# EAGLE design Moteino (EAGLE 7.7.0)
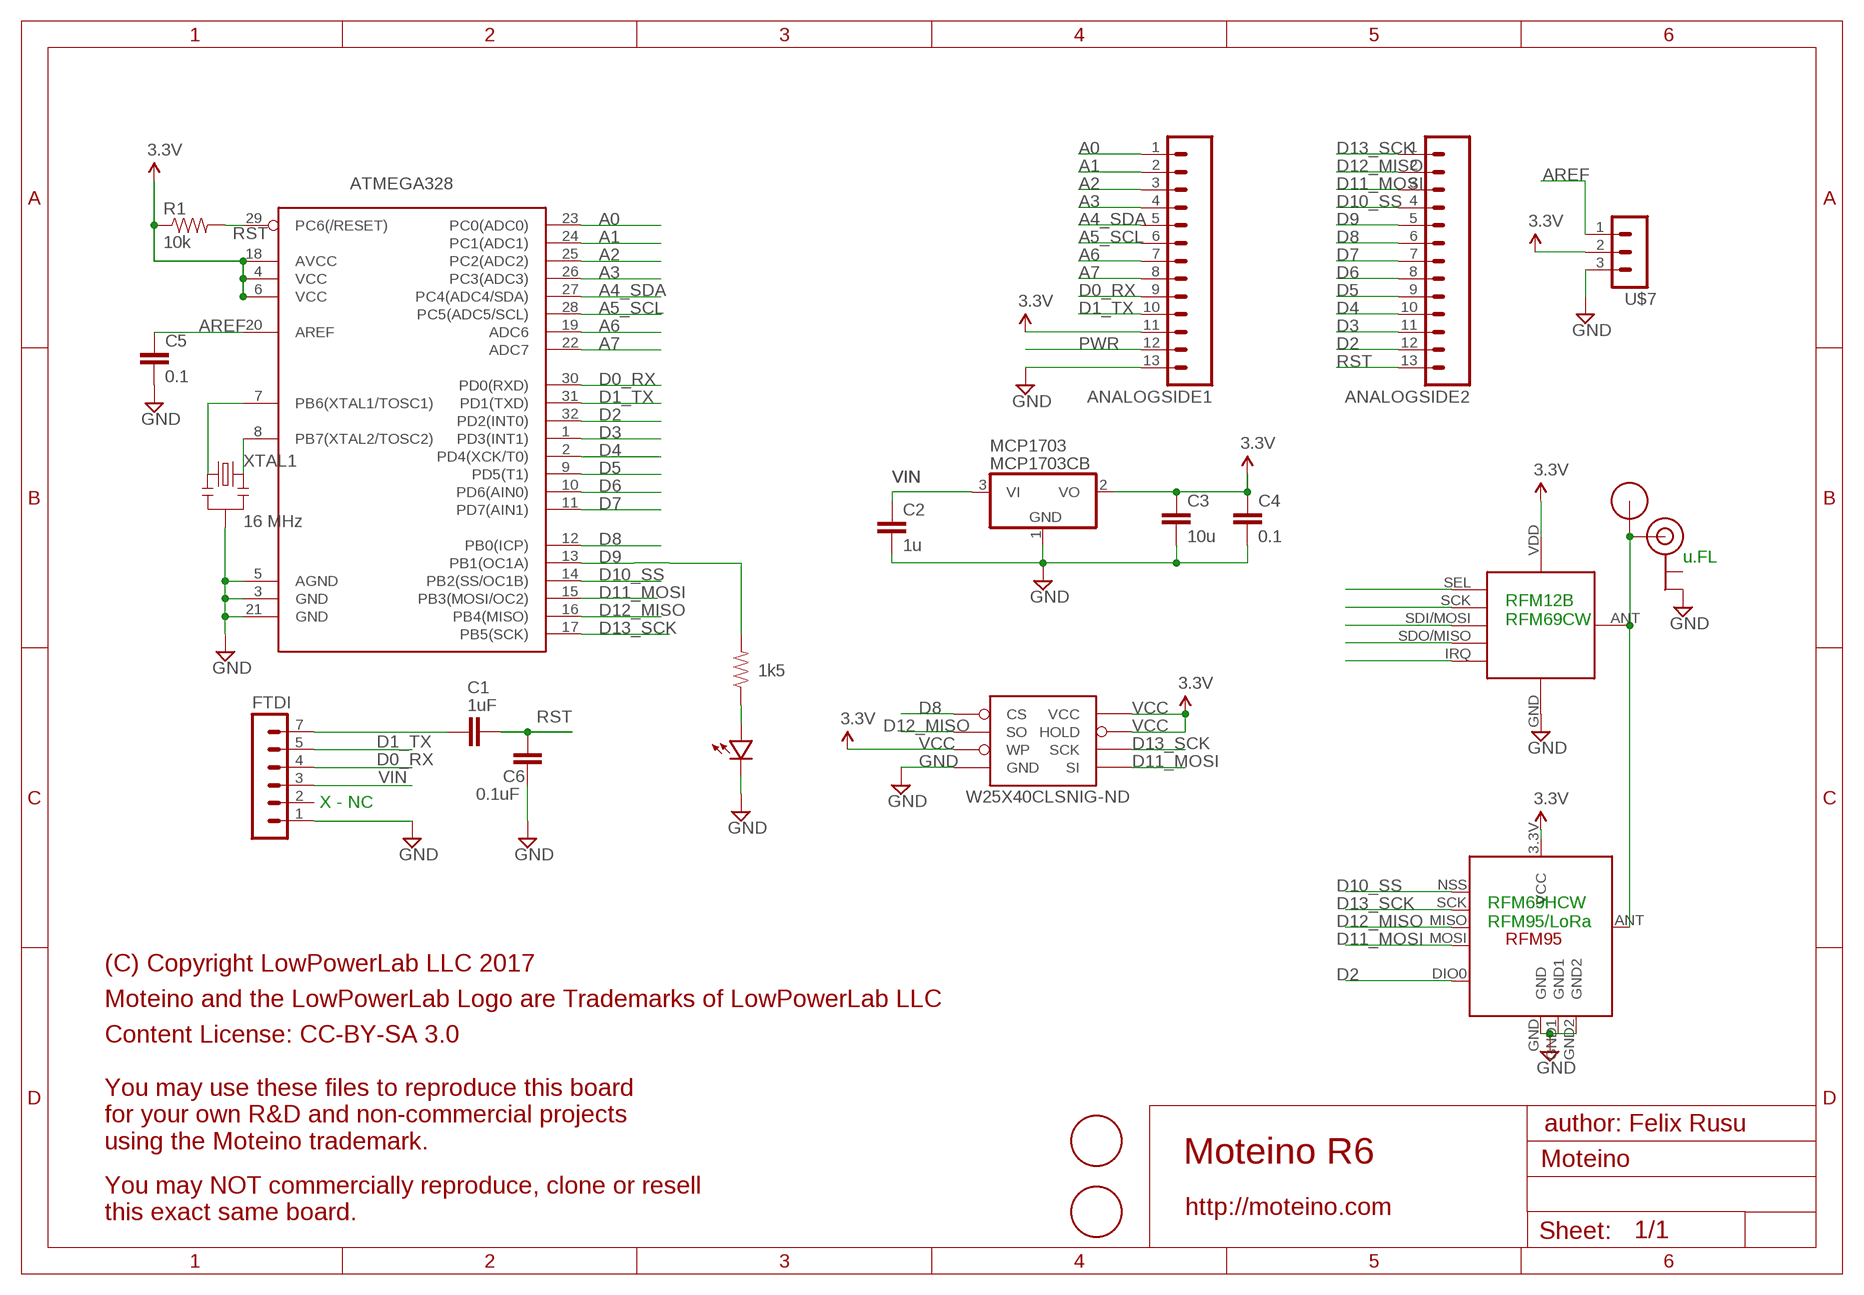
[diagram p0: schematic, sheet 1]

## Parts
ANALOGSIDE1  HDR_13PINTHIN_RINGS  [1X13_THINRINGS]
ANALOGSIDE2  HDR_13PINTHIN_RINGS  [1X13_THINRINGS]
ATMEGA328  ATMega-328  ATMEGA168/328TQFP32  [TQFP32-08]
C1  1uF  CAP0603-CAP  [0603-CAP]
C2  1u  CAP0603-CAP  [0603-CAP]
C3  10u  CAP0805-CAP  [0805-CAP]
C4  0.1  CAP0603-CAP  [0603-CAP]
C5  0.1  CAP0603-CAP  [0603-CAP]
C6  0.1uF  CAP0603-CAP  [0603-CAP]
FTDI  HDR_6PINTHINRINGS  [1X06_NS_THINRINGS]
LED  LED0603  [0603-LED]
MCP1703  MCP1703CB  [SOT23]
R1  10k  RESISTOR0603-RES  [0603-RES]
R2  1k5  RESISTOR0603-RES  [0603-RES]
U$1  RFM12B_ANTENNA""  [RFM12B-ANTENNA]
U$2  RFM95LONGER  [RFM95_LONGER]
U$4  U.FL  [U.FL]
U$5  FIDUCIAL1.5MM  [FIDUCIAL_1.5MM]
U$6  FIDUCIAL1.5MM  [FIDUCIAL_1.5MM]
U$7  HDR_3PINTHINRINGS  [1X03_NS_THINRINGS]
U$8  RFM12B_MINPADS  [RFM12B-MINPADS]
W25X40CLSNIG-ND  AT25F512BJEDEC_3.9MM  [SO08]
XTAL1  16 MHz  RESONATORSMD  [RESONATOR-SMD]

## Nets
A0: ANALOGSIDE1.1 ATMEGA328.23(PC0(ADC0))
A1: ANALOGSIDE1.2 ATMEGA328.24(PC1(ADC1))
A2: ANALOGSIDE1.3 ATMEGA328.25(PC2(ADC2))
A3: ANALOGSIDE1.4 ATMEGA328.26(PC3(ADC3))
A4_SDA: ANALOGSIDE1.5 ATMEGA328.27(PC4(ADC4/SDA))
A5_SCL: ANALOGSIDE1.6 ATMEGA328.28(PC5(ADC5/SCL))
A6: ANALOGSIDE1.7 ATMEGA328.19(ADC6)
A7: ANALOGSIDE1.8 ATMEGA328.22(ADC7)
AREF: ATMEGA328.20(AREF) C5.1 U$7.1
D0_RX: ANALOGSIDE1.9 ATMEGA328.30(PD0(RXD)) FTDI.4
D1_TX: ANALOGSIDE1.10 ATMEGA328.31(PD1(TXD)) FTDI.5
D2: ANALOGSIDE2.12 ATMEGA328.32(PD2(INT0)) U$2.DIO0 U$8.IRQ
D3: ANALOGSIDE2.11 ATMEGA328.1(PD3(INT1))
D4: ANALOGSIDE2.10 ATMEGA328.2(PD4(XCK/T0))
D5: ANALOGSIDE2.9 ATMEGA328.9(PD5(T1))
D6: ANALOGSIDE2.8 ATMEGA328.10(PD6(AIN0))
D7: ANALOGSIDE2.7 ATMEGA328.11(PD7(AIN1))
D8: ANALOGSIDE2.6 ATMEGA328.12(PB0(ICP)) W25X40CLSNIG-ND.1_CS(CS)
D9: ANALOGSIDE2.5 ATMEGA328.13(PB1(OC1A)) R2.2
D10_SS: ANALOGSIDE2.4 ATMEGA328.14(PB2(SS/OC1B)) U$2.NSS(SEL) U$8.SEL
D11_MOSI: ANALOGSIDE2.3 ATMEGA328.15(PB3(MOSI/OC2)) U$2.MOSI U$8.SDI/MOSI W25X40CLSNIG-ND.5_SI(SI)
D12_MISO: ANALOGSIDE2.2 ATMEGA328.16(PB4(MISO)) U$2.MISO U$8.SDO/MISO W25X40CLSNIG-ND.2_SO(SO)
D13_SCK: ANALOGSIDE2.1 ATMEGA328.17(PB5(SCK)) U$2.SCK U$8.SCK W25X40CLSNIG-ND.6_SCK(SCK)
GND [power]: ANALOGSIDE1.13 ATMEGA328.3(GND) ATMEGA328.5(AGND) ATMEGA328.21(GND) C2.2 C3.2 C4.2 C5.2 C6.2 FTDI.1 LED.MINUS MCP1703.1(GND) U$2.GND U$2.GND1 U$2.GND2 U$4.GND2(GND) U$7.3 U$8.GND W25X40CLSNIG-ND.4_GND(GND) XTAL1.2
N$1: ATMEGA328.7(PB6(XTAL1/TOSC1)) XTAL1.1
N$2: LED.PLUS R2.1
N$3: U$1.P$1 U$2.ANT U$4.SIGNAL U$8.ANT
N$20: C1.2 FTDI.7
N$21: ATMEGA328.8(PB7(XTAL2/TOSC2)) XTAL1.3
PWR [power]: ANALOGSIDE1.12
RST: ANALOGSIDE2.13 ATMEGA328.29(PC6(/RESET)) C1.1 C6.1 R1.2
VCC: ANALOGSIDE1.11 ATMEGA328.4(VCC) ATMEGA328.6(VCC) ATMEGA328.18(AVCC) C3.1 C4.1 MCP1703.2(VO) R1.1 U$2.3.3V(VCC) U$7.2 U$8.VDD W25X40CLSNIG-ND.3_WP(WP) W25X40CLSNIG-ND.7_HOLD(HOLD) W25X40CLSNIG-ND.8_VCC(VCC) ; supply symbol labelled 3.3V
VIN [power]: C2.1 FTDI.3 MCP1703.3(VI)
Unconnected: FTDI.2 U$4.GND1(GND) U$5.P$1(FIDUCIAL) U$6.P$1(FIDUCIAL)

## Notes on the sheet
- u.FL
- RFM12B
  RFM69CW
- X - NC
- RFM69HCW
  RFM95/LoRa
- (C) Copyright LowPowerLab LLC 2017
- Moteino and the LowPowerLab Logo are Trademarks of LowPowerLab LLC
- Content License: CC-BY-SA 3.0
- author: Felix Rusu
- You may use these files to reproduce this board
  for your own R&D and non-commercial projects
  using the Moteino trademark.
- Moteino R6
- http://moteino.com
- You may NOT commercially reproduce, clone or resell
  this exact same board.

## Library data of the parts
ANALOGSIDE1 ANALOGSIDE2 = LowPowerLab:HDR_13PIN
ATMEGA328 = LowPowerLab:ATMEGA168/328: Atmel 32-pin 8-bit micro, 16k flash.
C1-C6 = LowPowerLab:CAP: Capacitor Standard 0603 ceramic capacitor, and 0.1" leaded capacitor.
FTDI = LowPowerLab:HDR_6PIN
LED = LowPowerLab:LED
MCP1703 = linear:MCP1703: 250 mA, 16V, Low Quiescent Current LDO Regulator Source: http://ww1.microchip.com/downloads/en/DeviceDoc/22049b.pdf
R1 R2 = LowPowerLab:RESISTOR: Resistor Basic schematic elements and footprints for 0603, 1206, and PTH resistors.
U$1 = LowPowerLab:RFM12B_ANTENNA
U$2 = LowPowerLab:RFM95
U$4 = LowPowerLab:U.FL: SMD antenna connector- WRL-09144
U$5 U$6 = LowPowerLab:FIDUCIAL
U$7 = LowPowerLab:HDR_3PIN
U$8 = LowPowerLab:RFM12B_MINPADS
W25X40CLSNIG-ND = LowPowerLab:AT25F512B: 4-Mbit SPI flash memory
XTAL1 = SparkFun:RESONATOR: Resonator Small SMD resonator. This is the itty bitty 10/20MHz resonators with built in caps. CSTCE10M0G55 and CSTCE20M0V53. Footprint has been reviewed closely but hasn't been tested yet.

## Net classes
1 power: width 0.381 mm, clearance 0.254 mm

## Board
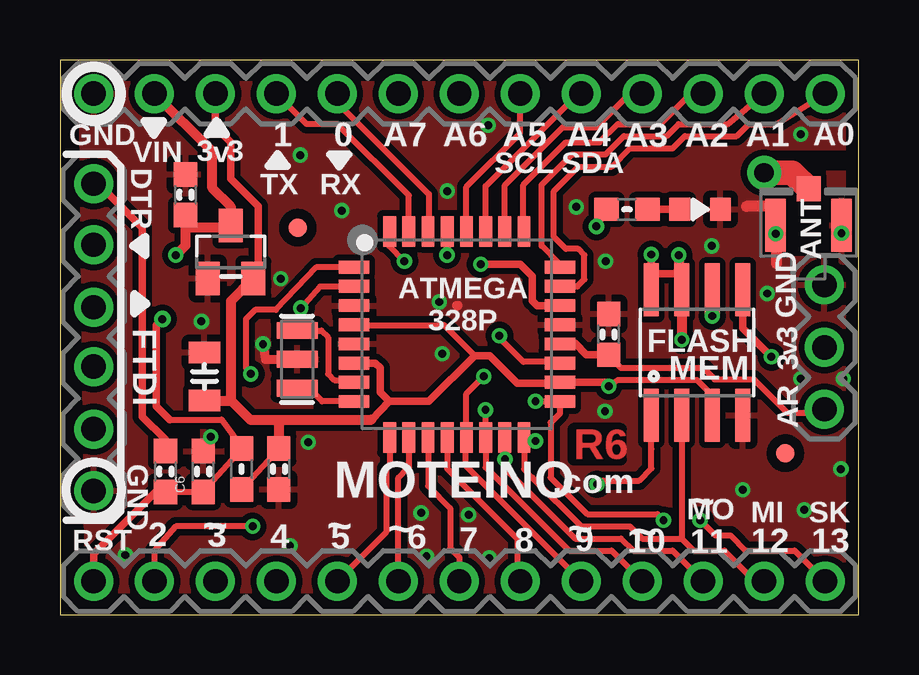
[diagram p1: board, top side]
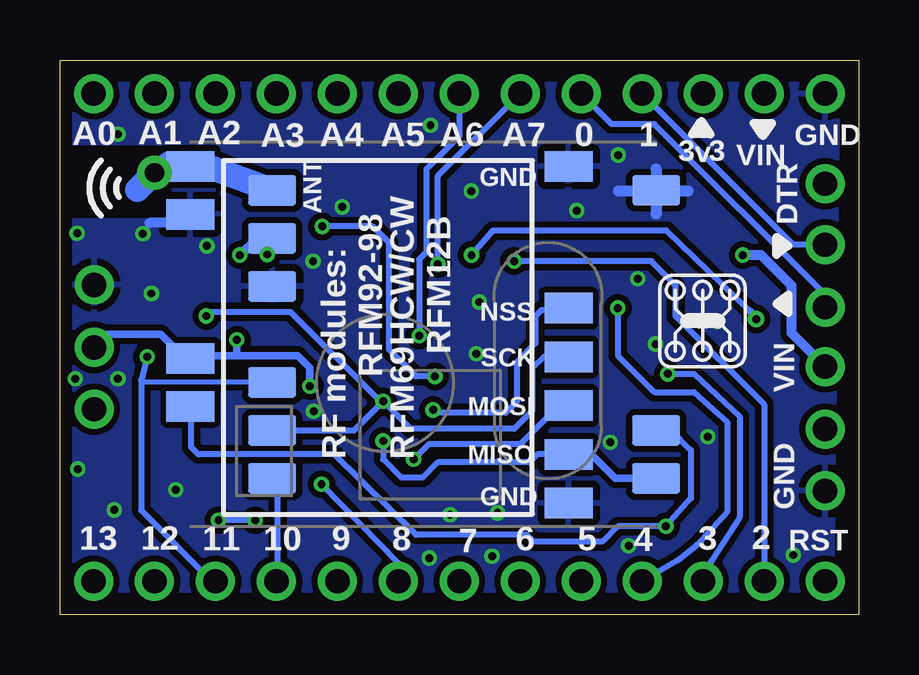
[diagram p2: board, bottom side, seen from below]

Size 33.27 x 23.11 mm. Coordinates in mm from the lower left corner, seen from the top.
Outline: 0,0 33.27,0 33.27,23.11 0,23.11 0,0
Copper layers (1*16): Top 0.035mm / dielectric 1.5mm / Bottom 0.035mm
Design rules "ITEADstudio_DRC *": minimum track width 6mil, minimum drill 12mil, track to track 6mil, track to pad 6mil, pad to pad 6mil, via to via 6mil, smd to smd 0mil, copper to edge 10mil, drill to drill 10mil, minimum pad ring 10mil, minimum via ring 6mil, stop-mask expansion 2mil, vias tented up to drill 100mil, thermal gap 12mil
tRestrict: area 5.2,9.7 to 6.7,10.4; area 30.5,15.1 to 31.9,16.9; area 29.2,18.7 to 32.9,19.2; area 32.4,17.4 to 32.7,17.5
bRestrict: area 26.6,16.8 to 26.8,17; area 26.6,16.5 to 26.8,16.6; area 10.8,4.8 to 11,4.9; area 10.8,4.4 to 11,4.5; area 13.1,4.8 to 13.4,5; area 13.1,4.4 to 13.4,4.5; area 12.2,19.3 to 12.4,19.6; area 12,17.8 to 12.2,18; area 10.8,18.8 to 11,19; area 10.8,18.4 to 11,18.5; area 13.1,18.8 to 13.4,19; area 13.1,18.4 to 13.4,18.5; 7 more areas

### Footprints (pad centres in the part's own frame; a part is rotated, then mirrored left to right if it is on the bottom)
1X13_THINRINGS = drill 1.016 pad 1.626: 1 0,0; 2 2.54,0; 3 5.08,0; 4 7.62,0; 5 10.16,0; 6 12.7,0; 7 15.24,0; 8 17.78,0; 9 20.32,0; 10 22.86,0; 11 25.4,0; 12 27.94,0; 13 30.48,0
TQFP32-08 = smd 1.27 x 0.533: 1 -4.293,2.8; 2 -4.293,2; 3 -4.293,1.2; 4 -4.293,0.4; 5 -4.293,-0.4; 6 -4.293,-1.2; 7 -4.293,-2; 8 -4.293,-2.8; 17 4.293,-2.8; 18 4.293,-2; 19 4.293,-1.2; 20 4.293,-0.4; 21 4.293,0.4; 22 4.293,1.2; 23 4.293,2; 24 4.293,2.8 | smd 0.533 x 1.27: 9 -2.8,-4.293; 10 -2,-4.293; 11 -1.2,-4.293; 12 -0.4,-4.293; 13 0.4,-4.293; 14 1.2,-4.293; 15 2,-4.293; 16 2.8,-4.293; 25 2.8,4.293; 26 2,4.293; 27 1.2,4.293; 28 0.4,4.293; 29 -0.4,4.293; 30 -1.2,4.293; 31 -2,4.293; 32 -2.8,4.293
0603-CAP = smd 1.016 x 0.965: 1 -0.85,0; 2 0.85,0
0805-CAP = smd 0.902 x 1.3: 1 -1,0; 2 1,0
1X06_NS_THINRINGS = drill 1.016 pad 1.626: 1 -0.051,0; 2 2.527,0; 3 5.131,0; 4 7.607,0; 5 10.211,0; 7 12.751,0
0603-LED = smd 0.864 x 0.965: MINUS -0.85,0; PLUS 0.85,0
SOT23 = smd 1 x 1.4: 1 -0.95,-1.1; 2 0.95,-1.1; 3 0,1.1
0603-RES = smd 1.016 x 0.965: 1 -0.85,0; 2 0.85,0
RFM12B-ANTENNA = drill 0.8 pad 1.422: P$1 0,0
RFM95_LONGER = smd 2 x 1.27: 3.3V 7.651,1; ANT 7.651,-7; DIO0 7.651,3; GND 7.651,-5; GND1 -8.107,-7; GND2 -8.107,7.032; MISO -8.107,5; MOSI -8.107,2.968; NSS -8.107,-1.096; SCK -8.107,0.936
U.FL = smd 2.2 x 0.85: GND1 0,1.375; GND2 0,-1.375 | smd 1.05 x 1: SIGNAL 1.525,0
FIDUCIAL_1.5MM = smd 0.762 x 0.762: P$1 0,0
1X03_NS_THINRINGS = drill 1.016 pad 1.626: 1 -0.051,0; 2 2.527,0; 3 5.131,0
RFM12B-MINPADS = smd 2 x 1.27: ANT 8,-6; GND 8,-2; IRQ -8,4; SCK 8,4; SDI1 -8.002,-6.001; SDI/MOSI 8,2; SDO/MISO -8,6; SEL 8,6; VDD 8,-4
SO08 = smd 0.61 x 2.21: 1_CS -1.905,-2.616; 2_SO -0.635,-2.616; 3_WP 0.635,-2.616; 4_GND 1.905,-2.616; 5_SI 1.905,2.616; 6_SCK 0.635,2.616; 7_HOLD -0.635,2.616; 8_VCC -1.905,2.616
RESONATOR-SMD = smd 0.7 x 1.7: 1 -1.2,0; 2 0,0; 3 1.2,0

### Placement (x,y rotation side)
ANALOGSIDE1  31.88,21.72 180 top
ANALOGSIDE2  31.88,1.4 180 top
ATMEGA328  16.54,11.68 0 top
C1  4.39,5.97 90 top
C2  5.23,17.5 90 top
C3  6.02,9.93 90 top
C4  9.12,6.07 270 top
C5  22.86,11.68 90 top
C6  5.97,5.97 90 top
FTDI  1.4,5.21 90 top
LED  26.67,16.89 180 top
MCP1703  7.11,15.11 0 top
R1  7.57,6.07 90 top
R2  23.62,16.89 180 top
U$1  29.34,18.41 0 top
U$2  20.19,11.68 180 bottom
U$3  [LOGO_LOWPOWERLAB]  6.5,12.24 270 bottom
U$4  31.19,16.23 90 top
U$5  9.91,16.13 0 top
U$6  30.23,6.73 0 top
U$7  31.85,8.61 90 top
U$8  16.43,11.68 180 bottom
W25X40CLSNIG-ND  26.54,10.92 0 top
XTAL1  9.88,10.64 270 top

### Tracks (layer width: path | path; a pad name or v marks a point on that pad's centre or on a via)
A0
  Top 0.254: ATMEGA328.23 21.56,13.68 21.84,13.97 21.84,14.99 21.59,15.24 21.08,15.24 20.57,15.75 20.57,17.65 21.59,18.67 22.99,18.67 23.75,19.43 25.53,19.43 26.04,19.94 28.19,19.94 28.7,20.45 29.84,20.45 ANALOGSIDE1.1
A1
  Top 0.254: ATMEGA328.24 20.83,14.61 20.07,15.37 20.07,17.91 21.34,19.18 22.73,19.18 23.5,19.94 25.27,19.94 25.78,20.45 27.81,20.45 ANALOGSIDE1.2
A2
  Top 0.254: 19.3,15.98 19.3,17.91 21.08,19.68 22.48,19.68 23.24,20.45 25.02,20.45 26.04,21.46 26.54,21.46 ANALOGSIDE1.3
  Top 0.381: ATMEGA328.25 19.3,15.98
A3
  Top 0.254: ATMEGA328.26 18.54,17.9 20.95,20.32 22.35,20.32 23.5,21.46 24,21.46 ANALOGSIDE1.4
A4_SDA
  Top 0.254: ATMEGA328.27 17.73,17.86 21.34,21.46 21.46,21.46 ANALOGSIDE1.5
A5_SCL
  Top 0.254: ATMEGA328.28 16.93,17.82 19.18,20.07 ANALOGSIDE1.6
A6  (via drill 0.33)
  Top 0.254: ATMEGA328.19 20.77,10.54 19.3,10.54 18.22,11.63 v18.31,11.63
  Bottom 0.254: ANALOGSIDE1.7 16.64,19.94 18.01,18.57 18.01,15.11 18.31,14.81 v18.31,11.63
A7  (via drill 0.33)
  Top 0.305: ATMEGA328.22 19.88,12.88 19.68,13.08 19.68,14.1 19.18,14.61 v17.53,14.61
  Bottom 0.254: v17.53,14.61 17.53,18.29 ANALOGSIDE1.8
AREF
  Top 0.254: C5.1 22.95,10.83 22.95,10.71 23.37,10.29 26.8,10.29 27.28,9.8 28.91,9.8 30.3,8.41 31.7,8.41 U$7.1
  Top 0.305: C5.1 21.93,10.83 21.46,11.3 20.85,11.3 ATMEGA328.20
D0_RX
  Top 0.254: 11.56,21.34 15.37,17.53 15.37,16.01 ATMEGA328.30
  Top 0.305: 11.56,21.34 ANALOGSIDE1.9
  Bottom 0.254: FTDI.4 1.4,13.34 8.51,20.45 10.29,20.45 ANALOGSIDE1.9
D1_TX
  Top 0.254: ATMEGA328.31 14.54,17.47 11.56,20.45 10.29,20.45 ANALOGSIDE1.10
  Bottom 0.254: FTDI.5 2.72,15.42 ANALOGSIDE1.10
D2  (via drill 0.33)
  Top 0.254: 13.72,15.83 13.72,15.37 v14.35,14.73 | v8.03,3.68 4.83,3.68 3.94,2.67 ANALOGSIDE2.12
  Top 0.381: 13.72,15.83 ATMEGA328.32
  Bottom 0.254: 27.81,8.65 U$2.DIO0 27.81,8.65 | ANALOGSIDE2.12 3.94,3.05 3.94,3.3 3.94,3.81 3.94,8.76 7.62,12.45 7.62,13.72 8.64,14.73 v14.35,14.73 | U$8.IRQ 7.81,7.68 6.99,6.86 6.99,4.85 v8.03,3.68 10.03,3.68 10.67,3.05 13.54,3.05 13.82,3.33 18.44,3.33 21.84,6.68 27.51,6.68 | 27.51,6.68 27.81,6.99 | 27.81,6.99 27.81,8.65 | 27.51,6.68 27.81,6.99
D3  (via drill 0.33)
  Top 0.254: ATMEGA328.1 10.67,14.48 8.99,12.7 8.13,12.7 7.75,12.32 7.75,10.29 v7.95,10.03
  Top 0.305: ATMEGA328.1
  Top 0.381: ATMEGA328.1
  Bottom 0.254: ANALOGSIDE2.11 6.1,2.29 4.95,4.06 4.95,8.26 6.86,10.03 v7.95,10.03
D4  (via drill 0.33)
  Top 0.254: v10.03,12.78 10.84,13.68 ATMEGA328.2
  Top 0.381: 12.17,13.73 ATMEGA328.2
  Bottom 0.254: ANALOGSIDE2.10 7.49,2.29 6.73,2.92 5.46,4.32 5.46,8 6.86,9.27 8.51,9.27 10.03,10.79 v10.03,12.78
D5
  Top 0.254: ATMEGA328.9 13.73,6.24 13.59,6.1 13.59,3.43 ANALOGSIDE2.9
D6
  Top 0.254: ANALOGSIDE2.8 14.1,5.71 14.48,6.1 14.54,6.15 ATMEGA328.10
D7
  Top 0.254: ATMEGA328.11 15.34,5.37 16.26,4.45 16.26,2.77 16.64,2.39 ANALOGSIDE2.7
D8  (via drill 0.33)
  Top 0.254: 24.62,7.75 24.64,7.73 24.64,6.91 24.64,6.1 24.13,5.59 22.63,5.59 22.61,5.56 v22.38,5.44 | ATMEGA328.12 16.14,6.09 19.05,3.17 19.05,1.52 ANALOGSIDE2.6
  Top 0.305: 24.62,7.75 W25X40CLSNIG-ND.1_CS | 19.05,1.52 ANALOGSIDE2.6
  Bottom 0.254: v22.38,5.44 19.18,2.16 ANALOGSIDE2.6
D9  (via drill 0.33)
  Top 0.254: ATMEGA328.13 16.93,9.21 v17.65,9.93 | 16.89,7.31 16.89,6.22 19.3,3.81 19.56,3.56 ANALOGSIDE2.5
  Top 0.305: R2.2 22.73,16.85 v22.35,16.18
  Top 0.381: 16.89,7.31 ATMEGA328.13
  Bottom 0.254: v17.65,9.93 18.44,9.93 19.56,11.05 19.56,15.49 20.24,16.18 v22.35,16.18
D10_SS  (via drill 0.33)
  Top 0.254: v17.73,8.53 17.73,8.43 ATMEGA328.14 17.73,6.14 21.21,2.67 22.99,2.67 ANALOGSIDE2.4
  Bottom 0.254: U$2.NSS 12.67,12.7 13.21,12.7 13.46,12.45 13.46,11.3 14.22,10.54 14.22,8.89 14.71,8.41 17.6,8.41 v17.73,8.53 | 24.73,5.68 U$8.SEL 24.63,5.68 24.21,5.26 24.21,1.45 ANALOGSIDE2.4
D11_MOSI  (via drill 0.33)
  Top 0.254: 18.54,7.36 18.54,6.45 | 18.54,6.45 18.54,6.1 20.95,3.68 21.46,3.17 23.37,3.17 23.88,2.67 25.53,2.67 ANALOGSIDE2.3 | v18.54,6.48 v18.54,6.47 18.54,6.45
  Top 0.305: v29.64,10.74 28.45,11.94 W25X40CLSNIG-ND.5_SI | ATMEGA328.15 18.54,7.36 18.54,6.45 18.54,6.36
  Top 0.381: ATMEGA328.15 18.54,7.36
  Bottom 0.203: U$8.SDI/MOSI 29.8,9.68 29.9,9.78
  Bottom 0.254: v29.64,10.74 29.9,9.78 29.9,4.34 26.95,1.4 ANALOGSIDE2.3 | U$2.MOSI 12.49,8.72 14.1,7.11 17.91,7.11 v18.54,6.48
D12_MISO  (via drill 0.33)
  Top 0.254: v19.81,7.24 ATMEGA328.16 19.34,6.07 19.68,5.71 21.72,3.68 23.75,3.68 24.26,3.17 25.91,3.17 | 25.91,3.17 26.42,2.67 27.69,2.67 28.83,1.52 29.21,1.52 ANALOGSIDE2.2 | W25X40CLSNIG-ND.2_SO 25.91,3.17
  Bottom 0.254: v19.81,7.24 19.81,6.48 19.05,5.71 18.16,5.71 17.53,6.35 13.72,6.35 13.38,6.68 U$2.MISO
  Bottom 0.305: U$8.SDO/MISO 10.13,5.68 11.05,6.6 12.01,6.6 U$2.MISO
D13_SCK  (via drill 0.33)
  Top 0.254: v19.81,8.89 ATMEGA328.17 20.83,8.38 20.45,8 20.45,5.71 21.97,4.19 24.89,4.19 v25.15,3.94 | W25X40CLSNIG-ND.6_SCK v27.18,12.45 | v26.67,3.94 27.3,3.3 27.94,3.3 28.57,2.67 30.61,2.67 ANALOGSIDE2.1
  Bottom 0.254: U$2.SCK 13.13,10.75 13.59,10.29 13.59,8.51 14.35,7.75 18.67,7.75 v19.81,8.89 | v19.81,8.89 19.94,8.89 23.67,12.62 26.98,12.62 v27.18,12.45 | U$8.SCK 21.02,7.68 v19.81,8.89 | v25.15,3.94 v26.67,3.94
GND  (via drill 0.33)
  Top 0.254: C6.2 6.28,6.82 v6.28,7.42
  Top 0.381: 20.94,12.06 ATMEGA328.21 | 16.53,12.88 16.59,12.88 | v8.46,11.28 8.56,10.64 XTAL1.2
  Top 0.457: 29.97,17.02 28.6,17.02 | 29.84,16 29.84,14.63
  Top 0.508: 22.99,12.41 C5.2
  Bottom 0.406: 27.66,16.33 29.54,16.33
  Bottom 0.457: 8.43,18.57 8.43,16.69 | 7.11,17.65 10.01,17.65
  other vias: 5.89,12.22 9.58,2.87 9.2,14 11.74,16.84 16.14,17.65 15.93,10.87 10.01,19.15 17.84,20.4 28.45,5.21 22.71,8.48 22.73,14.73 29.46,13.39 15.81,13.03 31.01,4.37 21.51,16.99 10.34,7.19 15.04,4.24 30.86,20.02 32.54,6.07 27.15,15.37 17.02,4.17 2.72,2.49 17.89,2.36 15.27,2.44 29.82,15.88 32.56,15.9 32.64,9.83 30.86,9.83
  pour Bottom: 0.86,22.12 1.12,0.99 32.66,0.99 32.66,22.12
  pour Top: 0.86,22.12 1.12,0.99 32.66,0.99 32.66,22.12
N$1
  Top 0.254: XTAL1.1 10.89,11.84 11.18,11.56 11.18,10.03 11.43,9.78 12.15,9.78 ATMEGA328.7
N$2
  Top 0.305: R2.1 24.55,16.89 LED.PLUS
N$3
  Top 1.016: U$4.SIGNAL 30.5,18.42 U$1.P$1
  Bottom 0.254: U$1.P$1
  Bottom 0.305: U$2.ANT
  Bottom 0.406: U$2.ANT 28.07,18.68
  Bottom 0.762: 28.75,18.8 U$2.ANT
  Bottom 1.016: U$1.P$1 28.75,18.8 | U$1.P$1 30.05,17.7 | U$2.ANT 27.13,18.67 27.07,18.67 U$8.ANT
N$20
  Top 0.305: C1.2 4.38,7.3 3.43,8.26 3.43,16.13 1.6,17.96 FTDI.7
N$21
  Top 0.254: ATMEGA328.8 10.92,8.89 10.44,9.37 9.95,9.37 XTAL1.3
  Top 0.305: XTAL1.3 9.73,9.44 | ATMEGA328.8
PWR
  Top 0.406: ANALOGSIDE1.12 6.35,19.3 6.35,17.78 7.11,17.02 7.11,16.64 7.03,16.55 7.03,16.13
RST  (via drill 0.33, 0.33 pad 0.69)
  Top 0.254: 4.57,8.13 6.73,8.13 7.19,7.49 R1.2 5.97,5.14 C6.1 5.92,5.12 C1.1 4.39,5.21 4.06,5.21
  Top 0.305: 4.57,8.13 4.01,8.69 4.01,12.06 v4.27,12.32 | ATMEGA328.29 16.14,15.12 v16.13,14.99 | ANALOGSIDE2.13 1.4,2.54 4.06,5.21
  Bottom 0.254: 4.52,12.65 8,16 15.24,16 v16.13,14.99
  Bottom 0.305: 16.01,15.09 v16.14,14.99 v16.13,14.99 | 4.52,12.65 v4.27,12.32
VCC  (via drill 0.33)
  Top 0.254: ATMEGA328.4 12.22,12.06 16,12.06 17.27,10.79 | W25X40CLSNIG-ND.3_WP 27.18,9.14 26.54,9.78 23.24,9.78 v22.86,9.53 | 24.64,13.21 24.64,13.26 W25X40CLSNIG-ND.8_VCC | 7.92,8.13 9.12,8.08 | R1.1 C4.1
  Top 0.305: ATMEGA328.6 13.14,10.48 13.34,10.29 13.34,9.27 13.72,8.89 | 13.72,8.89 15.37,8.89 17.27,10.79 17.91,10.79 19.05,9.65 20.8,9.65 ATMEGA328.18 22.83,9.68 v22.86,9.53 | MCP1703.2 8.26,14.21 8.26,17.02 7.11,18.16 7.11,19.68 6.48,20.32 ANALOGSIDE1.11 | 13.72,8.89 12.98,8.13 | W25X40CLSNIG-ND.7_HOLD 25.91,14.2 | 25.91,14.2 25.91,13.08 25.91,14.2 | 24.64,13.21 24.66,13.23 24.64,13.26 v24.64,15.01 | 24.89,14.2 25.91,14.2
  Top 0.406: 6.24,8.93 7.13,8.93 | MCP1703.2 7.13,13.08 7.13,8.93 | v25.78,14.99 25.78,14.35 25.91,14.2 | 25.91,14.2 W25X40CLSNIG-ND.7_HOLD | 25.91,14.2 v25.91,11.46 | 7.13,8.93 7.92,8.13 12.98,8.13 | 9.12,8.08 C4.1
  Top 0.508: C3.1 6.24,8.93 | 8,13.95 MCP1703.2 8.23,13.84
  Top 0.635: 8.23,13.73 8.23,13.84
  Bottom 0.254: 28.08,10.68 U$2.3.3V 27.19,10.79
  Bottom 0.305: 28.08,10.68 29.08,11.68 29.21,11.68 31.3,11.68 U$7.2 | 25.08,15.68 U$8.VDD 24.64,15.37 v24.64,15.01 | v22.86,9.53 22.86,9.91 22.86,10.29 23.37,10.79 25.91,10.79 | 25.91,10.79 27.19,10.79 | v25.91,11.46 25.91,10.79
  Bottom 0.406: 25.08,15.68 25.38,15.34 v25.78,14.99
VIN  (via drill 0.33)
  Top 0.406: v4.83,14.99 5.23,15.39 5.23,16.13 | 5.23,16.13 C2.1 | MCP1703.3 7.03,16.13 5.23,16.13
  Bottom 0.406: FTDI.3 2.79,11.73 2.79,13.72 4.06,14.99 v4.83,14.99

### Text on the board
Top: R6
tPlace: 1 | 0 | A7 | A6 | A5 | A4 | A1 | GND | VIN | 3 | v | 3 | A3 | A2 | A0 | DTR | TX | RX | SCL | SDA | ANT | ATMEGA / 328P | 3 | GND | FLASH | 3 | v | MEM | AR | FTDI | GND | .com | MOTEINO | 2 | 3 | 4 | 5 | 6 | 7 | 8 | 9 | 10 | MO | ~ | 11 | MI | 12 | SK | 13 | RST | ~ | ~ | ~ | ~ | ~
bPlace: 1 | 0 | A7 | A6 | A5 | A4 | A2 | A1 | A0 | GND | VIN | 3 | v | 3 | A3 | GND | ANT | DTR | RFM12B | RFM92-98 | NSS | RFM69HCW/CW | RF modules: | SCK | VIN | MOSI | MISO | GND | GND | 2 | 3 | 4 | 5 | 6 | 7 | 8 | 9 | 10 | 11 | 12 | 13 | RST
tStop: R6
tDocu: REG